# EAGLE design keymatrix (EAGLE 5.06)
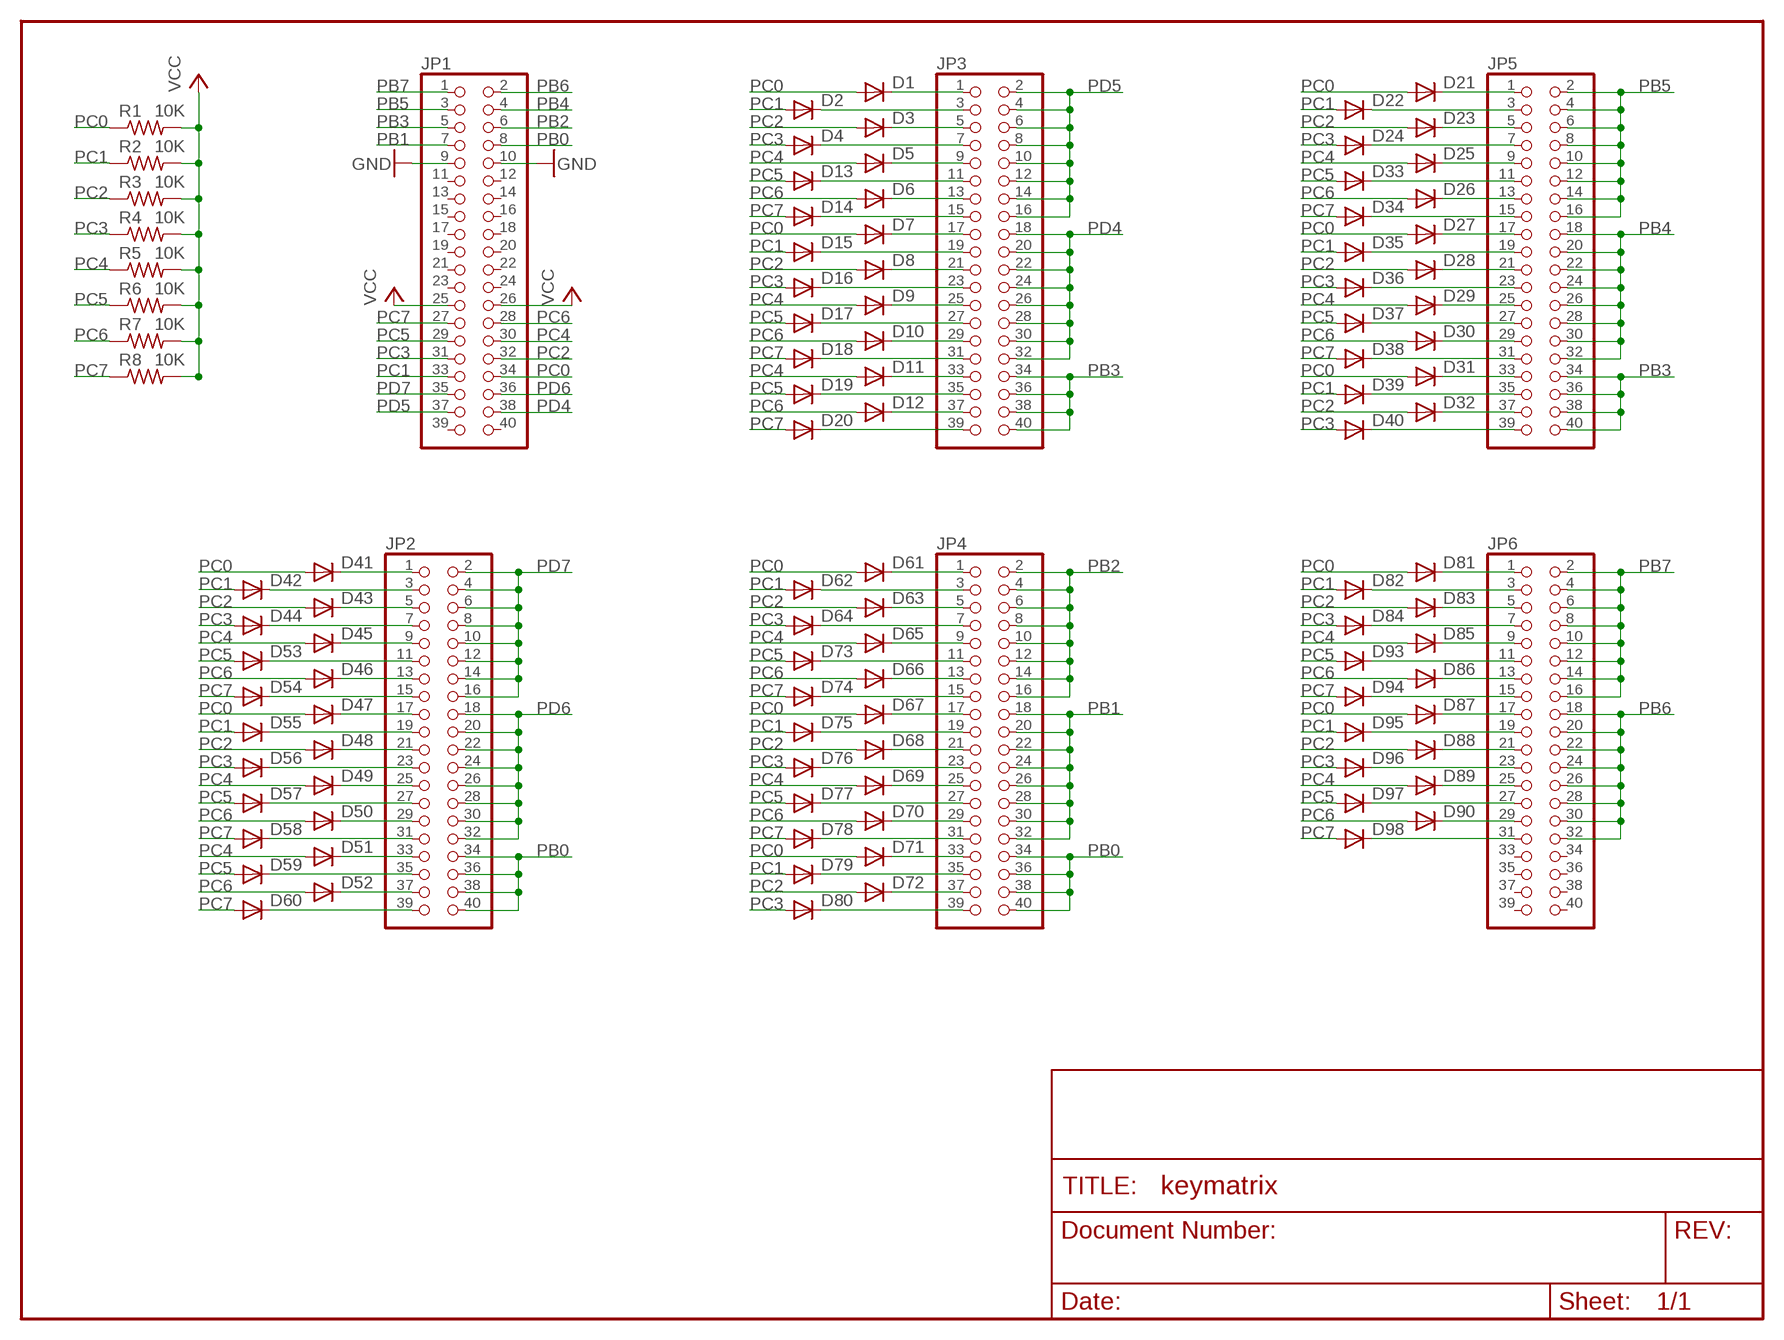
[diagram p0: schematic, sheet 1]

## Parts
D1  1N4148DO35-7  [DO35-7]
D2  1N4148DO35-7  [DO35-7]
D3  1N4148DO35-7  [DO35-7]
D4  1N4148DO35-7  [DO35-7]
D5  1N4148DO35-7  [DO35-7]
D6  1N4148DO35-7  [DO35-7]
D7  1N4148DO35-7  [DO35-7]
D8  1N4148DO35-7  [DO35-7]
D9  1N4148DO35-7  [DO35-7]
D10  1N4148DO35-7  [DO35-7]
D11  1N4148DO35-7  [DO35-7]
D12  1N4148DO35-7  [DO35-7]
D13  1N4148DO35-7  [DO35-7]
D14  1N4148DO35-7  [DO35-7]
D15  1N4148DO35-7  [DO35-7]
D16  1N4148DO35-7  [DO35-7]
D17  1N4148DO35-7  [DO35-7]
D18  1N4148DO35-7  [DO35-7]
D19  1N4148DO35-7  [DO35-7]
D20  1N4148DO35-7  [DO35-7]
D21  1N4148DO35-7  [DO35-7]
D22  1N4148DO35-7  [DO35-7]
D23  1N4148DO35-7  [DO35-7]
D24  1N4148DO35-7  [DO35-7]
D25  1N4148DO35-7  [DO35-7]
D26  1N4148DO35-7  [DO35-7]
D27  1N4148DO35-7  [DO35-7]
D28  1N4148DO35-7  [DO35-7]
D29  1N4148DO35-7  [DO35-7]
D30  1N4148DO35-7  [DO35-7]
D31  1N4148DO35-7  [DO35-7]
D32  1N4148DO35-7  [DO35-7]
D33  1N4148DO35-7  [DO35-7]
D34  1N4148DO35-7  [DO35-7]
D35  1N4148DO35-7  [DO35-7]
D36  1N4148DO35-7  [DO35-7]
D37  1N4148DO35-7  [DO35-7]
D38  1N4148DO35-7  [DO35-7]
D39  1N4148DO35-7  [DO35-7]
D40  1N4148DO35-7  [DO35-7]
D41  1N4148DO35-7  [DO35-7]
D42  1N4148DO35-7  [DO35-7]
D43  1N4148DO35-7  [DO35-7]
D44  1N4148DO35-7  [DO35-7]
D45  1N4148DO35-7  [DO35-7]
D46  1N4148DO35-7  [DO35-7]
D47  1N4148DO35-7  [DO35-7]
D48  1N4148DO35-7  [DO35-7]
D49  1N4148DO35-7  [DO35-7]
D50  1N4148DO35-7  [DO35-7]
D51  1N4148DO35-7  [DO35-7]
D52  1N4148DO35-7  [DO35-7]
D53  1N4148DO35-7  [DO35-7]
D54  1N4148DO35-7  [DO35-7]
D55  1N4148DO35-7  [DO35-7]
D56  1N4148DO35-7  [DO35-7]
D57  1N4148DO35-7  [DO35-7]
D58  1N4148DO35-7  [DO35-7]
D59  1N4148DO35-7  [DO35-7]
D60  1N4148DO35-7  [DO35-7]
D61  1N4148DO35-7  [DO35-7]
D62  1N4148DO35-7  [DO35-7]
D63  1N4148DO35-7  [DO35-7]
D64  1N4148DO35-7  [DO35-7]
D65  1N4148DO35-7  [DO35-7]
D66  1N4148DO35-7  [DO35-7]
D67  1N4148DO35-7  [DO35-7]
D68  1N4148DO35-7  [DO35-7]
D69  1N4148DO35-7  [DO35-7]
D70  1N4148DO35-7  [DO35-7]
D71  1N4148DO35-7  [DO35-7]
D72  1N4148DO35-7  [DO35-7]
D73  1N4148DO35-7  [DO35-7]
D74  1N4148DO35-7  [DO35-7]
D75  1N4148DO35-7  [DO35-7]
D76  1N4148DO35-7  [DO35-7]
D77  1N4148DO35-7  [DO35-7]
D78  1N4148DO35-7  [DO35-7]
D79  1N4148DO35-7  [DO35-7]
D80  1N4148DO35-7  [DO35-7]
D81  1N4148DO35-7  [DO35-7]
D82  1N4148DO35-7  [DO35-7]
D83  1N4148DO35-7  [DO35-7]
D84  1N4148DO35-7  [DO35-7]
D85  1N4148DO35-7  [DO35-7]
D86  1N4148DO35-7  [DO35-7]
D87  1N4148DO35-7  [DO35-7]
D88  1N4148DO35-7  [DO35-7]
D89  1N4148DO35-7  [DO35-7]
D90  1N4148DO35-7  [DO35-7]
D93  1N4148DO35-7  [DO35-7]
D94  1N4148DO35-7  [DO35-7]
D95  1N4148DO35-7  [DO35-7]
D96  1N4148DO35-7  [DO35-7]
D97  1N4148DO35-7  [DO35-7]
D98  1N4148DO35-7  [DO35-7]
JP1  PINHD-2X20  [2X20]
JP2  PINHD-2X20  [2X20]
JP3  PINHD-2X20  [2X20]
JP4  PINHD-2X20  [2X20]
JP5  PINHD-2X20  [2X20]
JP6  PINHD-2X20  [2X20]
R1  10K  R-US_0207/7  [0207/7]
R2  10K  R-US_0207/7  [0207/7]
R3  10K  R-US_0207/7  [0207/7]
R4  10K  R-US_0207/7  [0207/7]
R5  10K  R-US_0207/7  [0207/7]
R6  10K  R-US_0207/7  [0207/7]
R7  10K  R-US_0207/7  [0207/7]
R8  10K  R-US_0207/7  [0207/7]

## Nets
GND: JP1.9 JP1.10
N$1: D1.C JP3.1
N$2: D2.C JP3.3
N$3: D3.C JP3.5
N$4: D4.C JP3.7
N$5: D5.C JP3.9
N$6: D13.C JP3.11
N$7: D6.C JP3.13
N$8: D14.C JP3.15
N$9: D7.C JP3.17
N$10: D15.C JP3.19
N$11: D8.C JP3.21
N$12: D16.C JP3.23
N$13: D9.C JP3.25
N$14: D17.C JP3.27
N$15: D10.C JP3.29
N$16: D18.C JP3.31
N$17: D11.C JP3.33
N$18: D19.C JP3.35
N$19: D12.C JP3.37
N$20: D20.C JP3.39
N$21: D41.C JP2.1
N$22: D21.C JP5.1
N$23: D22.C JP5.3
N$24: D23.C JP5.5
N$25: D24.C JP5.7
N$26: D25.C JP5.9
N$27: D33.C JP5.11
N$28: D26.C JP5.13
N$29: D34.C JP5.15
N$30: D27.C JP5.17
N$31: D35.C JP5.19
N$32: D28.C JP5.21
N$33: D36.C JP5.23
N$34: D29.C JP5.25
N$35: D37.C JP5.27
N$36: D30.C JP5.29
N$37: D38.C JP5.31
N$38: D31.C JP5.33
N$39: D39.C JP5.35
N$40: D32.C JP5.37
N$41: D40.C JP5.39
N$42: D42.C JP2.3
N$43: D43.C JP2.5
N$44: D44.C JP2.7
N$45: D45.C JP2.9
N$46: D53.C JP2.11
N$47: D46.C JP2.13
N$48: D54.C JP2.15
N$49: D47.C JP2.17
N$50: D55.C JP2.19
N$51: D48.C JP2.21
N$52: D56.C JP2.23
N$53: D49.C JP2.25
N$54: D57.C JP2.27
N$55: D50.C JP2.29
N$56: D58.C JP2.31
N$57: D51.C JP2.33
N$58: D59.C JP2.35
N$59: D52.C JP2.37
N$60: D60.C JP2.39
N$61: D61.C JP4.1
N$62: D62.C JP4.3
N$63: D63.C JP4.5
N$64: D64.C JP4.7
N$65: D65.C JP4.9
N$66: D73.C JP4.11
N$67: D66.C JP4.13
N$68: D74.C JP4.15
N$69: D67.C JP4.17
N$70: D75.C JP4.19
N$71: D68.C JP4.21
N$72: D76.C JP4.23
N$73: D69.C JP4.25
N$74: D77.C JP4.27
N$75: D70.C JP4.29
N$76: D78.C JP4.31
N$77: D71.C JP4.33
N$78: D79.C JP4.35
N$79: D72.C JP4.37
N$80: D80.C JP4.39
N$81: D81.C JP6.1
N$82: D82.C JP6.3
N$83: D83.C JP6.5
N$84: D84.C JP6.7
N$85: D85.C JP6.9
N$86: D93.C JP6.11
N$87: D86.C JP6.13
N$88: D94.C JP6.15
N$89: D87.C JP6.17
N$90: D95.C JP6.19
N$91: D88.C JP6.21
N$92: D96.C JP6.23
N$93: D89.C JP6.25
N$94: D97.C JP6.27
N$95: D90.C JP6.29
N$96: D98.C JP6.31
PB0: JP1.8 JP2.34 JP2.36 JP2.38 JP2.40 JP4.34 JP4.36 JP4.38 JP4.40
PB1: JP1.7 JP4.18 JP4.20 JP4.22 JP4.24 JP4.26 JP4.28 JP4.30 JP4.32
PB2: JP1.6 JP4.2 JP4.4 JP4.6 JP4.8 JP4.10 JP4.12 JP4.14 JP4.16
PB3: JP1.5 JP3.34 JP3.36 JP3.38 JP3.40 JP5.34 JP5.36 JP5.38 JP5.40
PB4: JP1.4 JP5.18 JP5.20 JP5.22 JP5.24 JP5.26 JP5.28 JP5.30 JP5.32
PB5: JP1.3 JP5.2 JP5.4 JP5.6 JP5.8 JP5.10 JP5.12 JP5.14 JP5.16
PB6: JP1.2 JP6.18 JP6.20 JP6.22 JP6.24 JP6.26 JP6.28 JP6.30 JP6.32
PB7: JP1.1 JP6.2 JP6.4 JP6.6 JP6.8 JP6.10 JP6.12 JP6.14 JP6.16
PC0: D1.A D7.A D21.A D27.A D31.A D41.A D47.A D61.A D67.A D71.A D81.A D87.A JP1.34 R1.1
PC1: D2.A D15.A D22.A D35.A D39.A D42.A D55.A D62.A D75.A D79.A D82.A D95.A JP1.33 R2.1
PC2: D3.A D8.A D23.A D28.A D32.A D43.A D48.A D63.A D68.A D72.A D83.A D88.A JP1.32 R3.1
PC3: D4.A D16.A D24.A D36.A D40.A D44.A D56.A D64.A D76.A D80.A D84.A D96.A JP1.31 R4.1
PC4: D5.A D9.A D11.A D25.A D29.A D45.A D49.A D51.A D65.A D69.A D85.A D89.A JP1.30 R5.1
PC5: D13.A D17.A D19.A D33.A D37.A D53.A D57.A D59.A D73.A D77.A D93.A D97.A JP1.29 R6.1
PC6: D6.A D10.A D12.A D26.A D30.A D46.A D50.A D52.A D66.A D70.A D86.A D90.A JP1.28 R7.1
PC7: D14.A D18.A D20.A D34.A D38.A D54.A D58.A D60.A D74.A D78.A D94.A D98.A JP1.27 R8.1
PD4: JP1.38 JP3.18 JP3.20 JP3.22 JP3.24 JP3.26 JP3.28 JP3.30 JP3.32
PD5: JP1.37 JP3.2 JP3.4 JP3.6 JP3.8 JP3.10 JP3.12 JP3.14 JP3.16
PD6: JP1.36 JP2.18 JP2.20 JP2.22 JP2.24 JP2.26 JP2.28 JP2.30 JP2.32
PD7: JP1.35 JP2.2 JP2.4 JP2.6 JP2.8 JP2.10 JP2.12 JP2.14 JP2.16
VCC: JP1.25 JP1.26 R1.2 R2.2 R3.2 R4.2 R5.2 R6.2 R7.2 R8.2
Unconnected: JP1.11 JP1.12 JP1.13 JP1.14 JP1.15 JP1.16 JP1.17 JP1.18 JP1.19 JP1.20 JP1.21 JP1.22 JP1.23 JP1.24 JP1.39 JP1.40 JP6.33 JP6.34 JP6.35 JP6.36 JP6.37 JP6.38 JP6.39 JP6.40

## Library data of the parts
D1-D90 D93-D98 = diode:1N4148: DIODE high speed (Philips)
JP1-JP6 = pinhead:PINHD-2X20: PIN HEADER
R1-R8 = resistor:R-US_: RESISTOR, American symbol

## Board
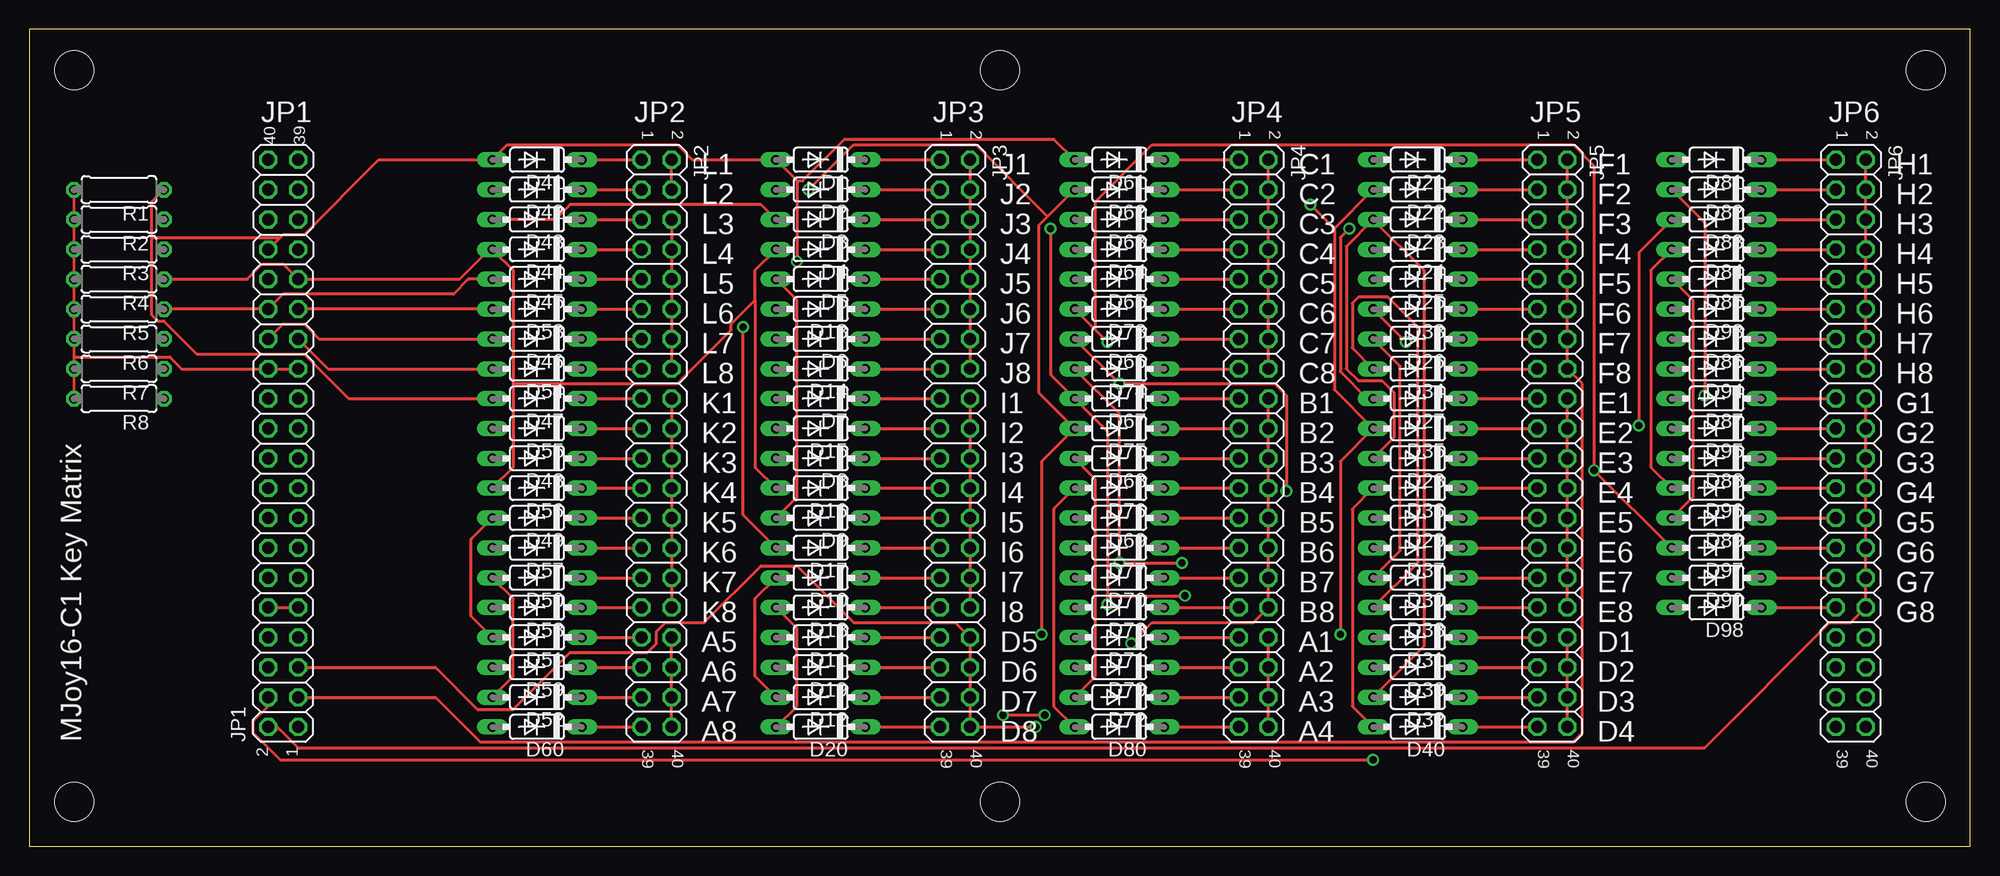
[diagram p1: board, top side]
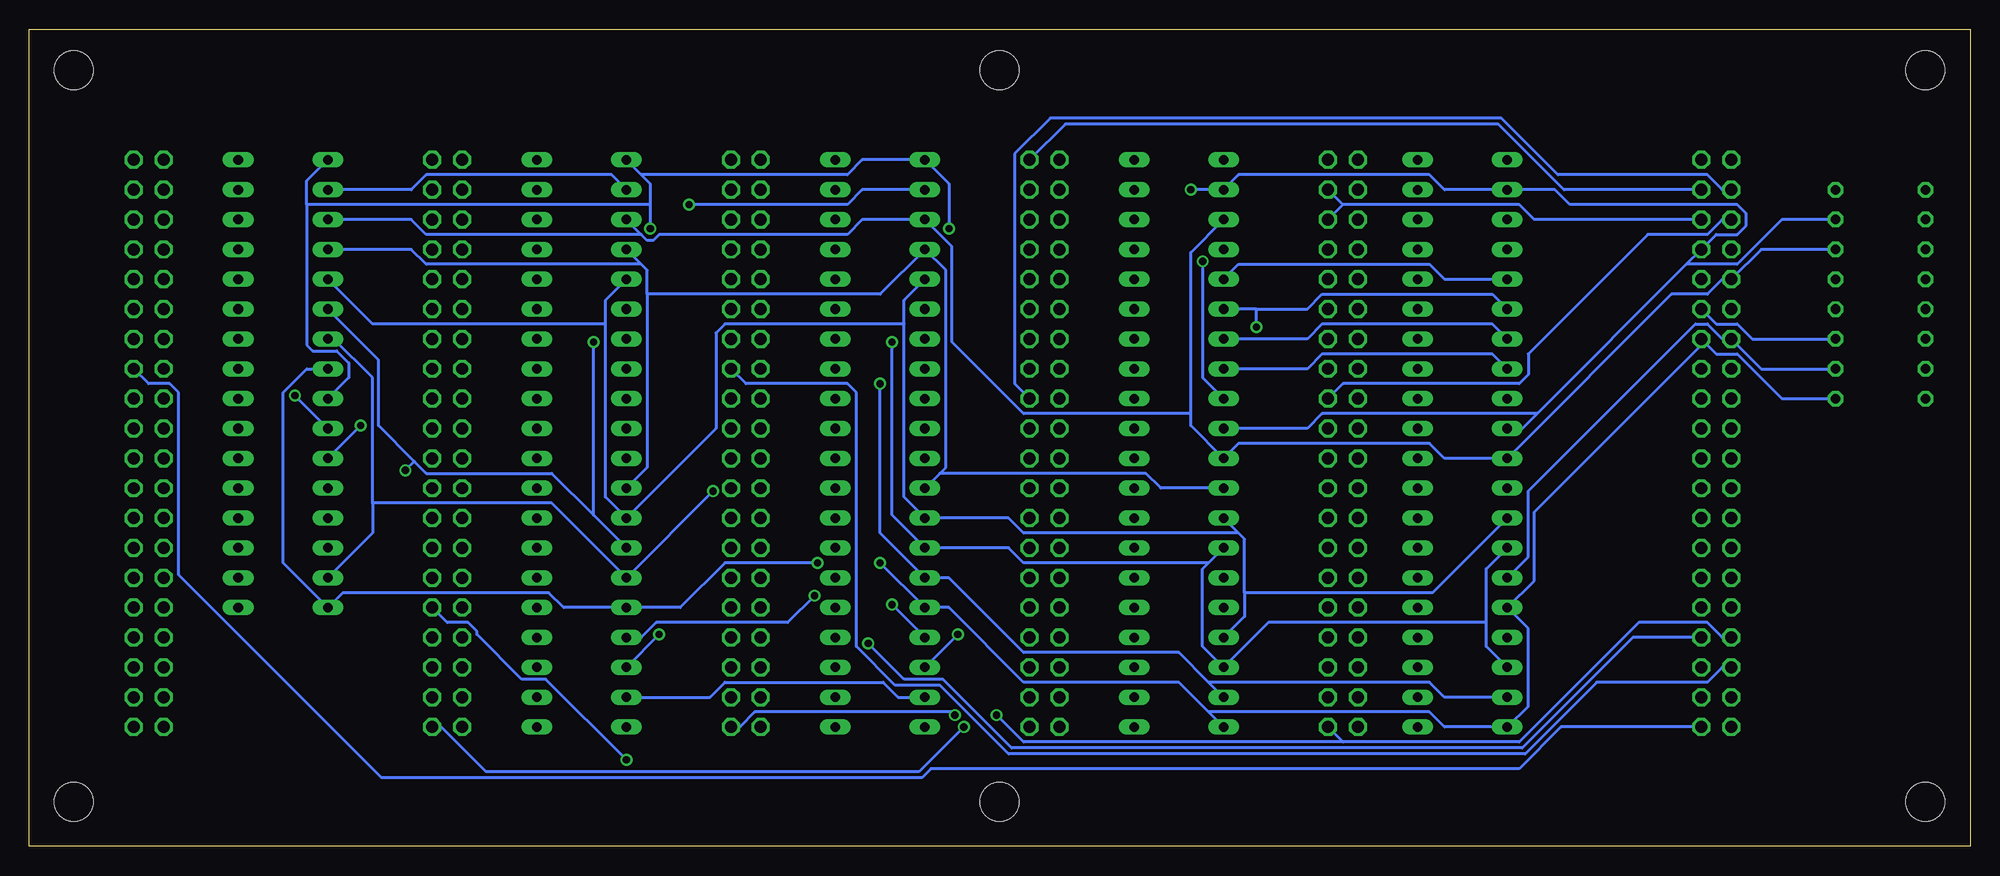
[diagram p2: board, bottom side, seen from below]

Size 165.08 x 69.52 mm. Coordinates in mm from the lower left corner, seen from the top.
Outline: 0,0 165.08,0 165.08,69.52 0,69.52 0,0
Copper layers (1*16): Top 0.035mm / dielectric 1.5mm / Bottom 0.035mm
Design rules "default": minimum track width 10mil, minimum drill 24mil, track to track 8mil, track to pad 8mil, pad to pad 8mil, via to via 8mil, smd to smd 8mil, copper to edge 40mil, drill to drill 8mil, minimum pad ring 10mil, minimum via ring 8mil, stop-mask expansion 4mil, vias tented up to drill 0mil, thermal gap 10mil

### Footprints (pad centres in the part's own frame; a part is rotated, then mirrored left to right if it is on the bottom)
DO35-7 = drill 0.813 long: A 3.81,0; C -3.81,0
2X20 = drill 1.016 octagon: 1 -24.13,-1.27; 2 -24.13,1.27; 3 -21.59,-1.27; 4 -21.59,1.27; 5 -19.05,-1.27; 6 -19.05,1.27; 7 -16.51,-1.27; 8 -16.51,1.27; 9 -13.97,-1.27; 10 -13.97,1.27; 11 -11.43,-1.27; 12 -11.43,1.27; 13 -8.89,-1.27; 14 -8.89,1.27; 15 -6.35,-1.27; 16 -6.35,1.27; 17 -3.81,-1.27; 18 -3.81,1.27; 19 -1.27,-1.27; 20 -1.27,1.27; 21 1.27,-1.27; 22 1.27,1.27; 23 3.81,-1.27; 24 3.81,1.27; 25 6.35,-1.27; 26 6.35,1.27; 27 8.89,-1.27; 28 8.89,1.27; 29 11.43,-1.27; 30 11.43,1.27; 31 13.97,-1.27; 32 13.97,1.27; 33 16.51,-1.27; 34 16.51,1.27; 35 19.05,-1.27; 36 19.05,1.27; 37 21.59,-1.27; 38 21.59,1.27; 39 24.13,-1.27; 40 24.13,1.27
0207/7 = drill 0.813 octagon: 1 -3.81,0; 2 3.81,0
STAND-OFF = hole 3.302: 0,0

### Placement (x,y rotation side)
D1  67.31,58.42 180 top
D2  67.31,55.88 180 top
D3  67.31,53.34 180 top
D4  67.31,50.8 180 top
D5  67.31,48.26 180 top
D6  67.31,43.18 180 top
D7  67.31,38.1 180 top
D8  67.31,33.02 180 top
D9  67.31,27.94 180 top
D10  67.31,22.86 180 top
D11  67.31,17.78 180 top
D12  67.31,12.7 180 top
D13  67.31,45.72 180 top
D14  67.31,40.64 180 top
D15  67.31,35.56 180 top
D16  67.31,30.48 180 top
D17  67.31,25.4 180 top
D18  67.31,20.32 180 top
D19  67.31,15.24 180 top
D20  67.31,10.16 180 top
D21  118.11,58.42 180 top
D22  118.11,55.88 180 top
D23  118.11,53.34 180 top
D24  118.11,50.8 180 top
D25  118.11,48.26 180 top
D26  118.11,43.18 180 top
D27  118.11,38.1 180 top
D28  118.11,33.02 180 top
D29  118.11,27.94 180 top
D30  118.11,22.86 180 top
D31  118.11,17.78 180 top
D32  118.11,12.7 180 top
D33  118.11,45.72 180 top
D34  118.11,40.64 180 top
D35  118.11,35.56 180 top
D36  118.11,30.48 180 top
D37  118.11,25.4 180 top
D38  118.11,20.32 180 top
D39  118.11,15.24 180 top
D40  118.11,10.16 180 top
D41  43.18,58.42 180 top
D42  43.18,55.88 180 top
D43  43.18,53.34 180 top
D44  43.18,50.8 180 top
D45  43.18,48.26 180 top
D46  43.18,43.18 180 top
D47  43.18,38.1 180 top
D48  43.18,33.02 180 top
D49  43.18,27.94 180 top
D50  43.18,22.86 180 top
D51  43.18,17.78 180 top
D52  43.18,12.7 180 top
D53  43.18,45.72 180 top
D54  43.18,40.64 180 top
D55  43.18,35.56 180 top
D56  43.18,30.48 180 top
D57  43.18,25.4 180 top
D58  43.18,20.32 180 top
D59  43.18,15.24 180 top
D60  43.18,10.16 180 top
D61  92.71,58.42 180 top
D62  92.71,55.88 180 top
D63  92.71,53.34 180 top
D64  92.71,50.8 180 top
D65  92.71,48.26 180 top
D66  92.71,43.18 180 top
D67  92.71,38.1 180 top
D68  92.71,33.02 180 top
D69  92.71,27.94 180 top
D70  92.71,22.86 180 top
D71  92.71,17.78 180 top
D72  92.71,12.7 180 top
D73  92.71,45.72 180 top
D74  92.71,40.64 180 top
D75  92.71,35.56 180 top
D76  92.71,30.48 180 top
D77  92.71,25.4 180 top
D78  92.71,20.32 180 top
D79  92.71,15.24 180 top
D80  92.71,10.16 180 top
D81  143.51,58.42 180 top
D82  143.51,55.88 180 top
D83  143.51,53.34 180 top
D84  143.51,50.8 180 top
D85  143.51,48.26 180 top
D86  143.51,43.18 180 top
D87  143.51,38.1 180 top
D88  143.51,33.02 180 top
D89  143.51,27.94 180 top
D90  143.51,22.86 180 top
D93  143.51,45.72 180 top
D94  143.51,40.64 180 top
D95  143.51,35.56 180 top
D96  143.51,30.48 180 top
D97  143.51,25.4 180 top
D98  143.51,20.32 180 top
JP1  21.59,34.29 90 top
JP2  53.34,34.29 270 top
JP3  78.74,34.29 270 top
JP4  104.14,34.29 270 top
JP5  129.54,34.29 270 top
JP6  154.94,34.29 270 top
R1  7.62,55.88 180 top
R2  7.62,53.34 180 top
R3  7.62,50.8 180 top
R4  7.62,48.26 180 top
R5  7.62,45.72 180 top
R6  7.62,43.18 180 top
R7  7.62,40.64 180 top
R8  7.62,38.1 180 top
U$1  [STAND-OFF]  3.81,3.81 0 top
U$2  [STAND-OFF]  3.81,66.04 0 top
U$3  [STAND-OFF]  161.29,3.81 0 top
U$4  [STAND-OFF]  161.29,66.04 0 top
U$5  [STAND-OFF]  82.55,66.04 0 top
U$6  [STAND-OFF]  82.55,3.81 0 top

### Tracks (layer width: path | path; a pad name or v marks a point on that pad's centre or on a via)
GND
  Top 0.254: JP1.10 JP1.9
N$1
  Top 0.254: D1.C JP3.1
N$2
  Top 0.254: D2.C JP3.3
N$3
  Top 0.254: D3.C JP3.5
N$4
  Top 0.254: D4.C JP3.7
N$5
  Top 0.254: D5.C JP3.9
N$6
  Top 0.254: D13.C JP3.11
N$7
  Top 0.254: D6.C JP3.13
N$8
  Top 0.254: D14.C JP3.15
N$9
  Top 0.254: D7.C JP3.17
N$10
  Top 0.254: D15.C JP3.19
N$11
  Top 0.254: D8.C JP3.21
N$12
  Top 0.254: D16.C JP3.23
N$13
  Top 0.254: D9.C JP3.25
N$14
  Top 0.254: D17.C JP3.27
N$15
  Top 0.254: D10.C JP3.29
N$16
  Top 0.254: D18.C JP3.31
N$17
  Top 0.254: D11.C JP3.33
N$18
  Top 0.254: D19.C JP3.35
N$19
  Top 0.254: D12.C JP3.37
N$20
  Top 0.254: D20.C JP3.39
N$21
  Top 0.254: D41.C JP2.1
N$22
  Top 0.254: D21.C JP5.1
N$23
  Top 0.254: D22.C JP5.3
N$24
  Top 0.254: D23.C JP5.5
N$25
  Top 0.254: D24.C JP5.7
N$26
  Top 0.254: D25.C JP5.9
N$27
  Top 0.254: D33.C JP5.11
N$28
  Top 0.254: D26.C JP5.13
N$29
  Top 0.254: D34.C JP5.15
N$30
  Top 0.254: D27.C JP5.17
N$31
  Top 0.254: D35.C JP5.19
N$32
  Top 0.254: D28.C JP5.21
N$33
  Top 0.254: D36.C JP5.23
N$34
  Top 0.254: D29.C JP5.25
N$35
  Top 0.254: D37.C JP5.27
N$36
  Top 0.254: D30.C JP5.29
N$37
  Top 0.254: D38.C JP5.31
N$38
  Top 0.254: D31.C JP5.33
N$39
  Top 0.254: D39.C JP5.35
N$40
  Top 0.254: D32.C JP5.37
N$41
  Top 0.254: D40.C JP5.39
N$42
  Top 0.254: D42.C JP2.3
N$43
  Top 0.254: D43.C JP2.5
N$44
  Top 0.254: D44.C JP2.7
N$45
  Top 0.254: D45.C JP2.9
N$46
  Top 0.254: D53.C JP2.11
N$47
  Top 0.254: D46.C JP2.13
N$48
  Top 0.254: D54.C JP2.15
N$49
  Top 0.254: D47.C JP2.17
N$50
  Top 0.254: D55.C JP2.19
N$51
  Top 0.254: D48.C JP2.21
N$52
  Top 0.254: D56.C JP2.23
N$53
  Top 0.254: D49.C JP2.25
N$54
  Top 0.254: D57.C JP2.27
N$55
  Top 0.254: D50.C JP2.29
N$56
  Top 0.254: D58.C JP2.31
N$57
  Top 0.254: D51.C JP2.33
N$58
  Top 0.254: D59.C JP2.35
N$59
  Top 0.254: D52.C JP2.37
N$60
  Top 0.254: D60.C JP2.39
N$61
  Top 0.254: D61.C JP4.1
N$62
  Top 0.254: D62.C JP4.3
N$63
  Top 0.254: D63.C JP4.5
N$64
  Top 0.254: D64.C JP4.7
N$65
  Top 0.254: D65.C JP4.9
N$66
  Top 0.254: D73.C JP4.11
N$67
  Top 0.254: D66.C JP4.13
N$68
  Top 0.254: D74.C JP4.15
N$69
  Top 0.254: D67.C JP4.17
N$70
  Top 0.254: D75.C JP4.19
N$71
  Top 0.254: D68.C JP4.21
N$72
  Top 0.254: D76.C JP4.23
N$73
  Top 0.254: D69.C JP4.25
N$74
  Top 0.254: D77.C JP4.27
N$75
  Top 0.254: D70.C JP4.29
N$76
  Top 0.254: D78.C JP4.31
N$77
  Top 0.254: D71.C JP4.33
N$78
  Top 0.254: D79.C JP4.35
N$79
  Top 0.254: D72.C JP4.37
N$80
  Top 0.254: D80.C JP4.39
N$81
  Top 0.254: D81.C JP6.1
N$82
  Top 0.254: D82.C JP6.3
N$83
  Top 0.254: D83.C JP6.5
N$84
  Top 0.254: D84.C JP6.7
N$85
  Top 0.254: D85.C JP6.9
N$86
  Top 0.254: D93.C JP6.11
N$87
  Top 0.254: D86.C JP6.13
N$88
  Top 0.254: D94.C JP6.15
N$89
  Top 0.254: D87.C JP6.17
N$90
  Top 0.254: D95.C JP6.19
N$91
  Top 0.254: D88.C JP6.21
N$92
  Top 0.254: D96.C JP6.23
N$93
  Top 0.254: D89.C JP6.25
N$94
  Top 0.254: D97.C JP6.27
N$95
  Top 0.254: D90.C JP6.29
N$96
  Top 0.254: D98.C JP6.31
PB0  (via drill 0.61)
  Top 0.254: JP4.40 JP4.38 JP4.36 JP4.34 | JP2.34 JP2.36 JP2.38 JP2.40 | v82.8,11.18 v86.36,11.18
  Bottom 0.254: JP1.8 21.08,17.78 22.35,19.05 28.19,19.05 38.35,8.89 53.34,8.89 | 53.34,8.89 JP2.40 | JP4.40 104.65,10.16 103.38,11.43 86.61,11.43 v86.36,11.18 | v82.8,11.18 80.52,8.89 53.34,8.89
PB1  (via drill 0.61)
  Top 0.254: JP4.18 JP4.20 JP4.22 JP4.24 JP4.26 JP4.28 JP4.30 JP4.32 104.14,19.05 95.5,19.05 v93.73,17.27
  Bottom 0.254: JP1.7 28.7,17.78 38.1,8.38 81.53,8.38 87.38,14.22 90.68,14.22 v93.73,17.27
PB2
  Top 0.254: JP4.2 JP4.4 JP4.6 JP4.8 JP4.10 JP4.12 JP4.14 JP4.16
  Bottom 0.254: JP1.6 21.08,15.24 22.35,13.97 31.75,13.97 37.85,7.87 81.79,7.87 87.63,13.72 91.44,13.72 94.74,17.02 94.74,38.61 95.5,39.37 104.14,39.37 JP4.16
PB3  (via drill 0.61)
  Top 0.254: JP5.40 JP5.38 JP5.36 JP5.34 | JP1.5 34.54,15.24 38.1,11.68 41.15,11.68 45.97,16.51 52.58,16.51 53.34,17.27 53.34,18.29 54.1,19.05 57.4,19.05 62.23,23.88 65.28,23.88 70.1,19.05 78.74,19.05 JP3.34 JP3.36 JP3.38 JP3.40 v85.6,10.16
  Bottom 0.254: JP5.40 130.05,10.16 126.24,6.35 89.41,6.35 v85.6,10.16
PB4  (via drill 0.61)
  Top 0.254: JP5.18 JP5.20 JP5.22 JP5.24 JP5.26 JP5.28 JP5.30 JP5.32 | JP1.4 20.32,11.94 19.05,10.67 19.05,9.65 21.34,7.37 v114.3,7.37
  Bottom 0.254: v114.3,7.37 121.16,14.22 123.19,14.22 127,18.03 127,18.29 127.76,19.05 129.54,19.05 JP5.32
PB5
  Top 0.254: JP5.2 JP5.4 JP5.6 JP5.8 JP5.10 JP5.12 JP5.14 JP5.16 132.08,39.37 132.08,9.65 131.32,8.89 38.35,8.89 34.54,12.7 JP1.3
PB6
  Top 0.254: JP6.18 JP6.20 JP6.22 JP6.24 JP6.26 JP6.28 JP6.30 JP6.32 154.94,19.05 153.16,19.05 142.49,8.38 22.86,8.38 21.08,10.16 JP1.2
PB7
  Top 0.254: JP6.2 JP6.4 JP6.6 JP6.8 JP6.10 JP6.12 JP6.14 JP6.16
  Bottom 0.254: JP1.1 34.8,10.16 38.35,6.6 88.39,6.6 89.15,5.84 135.13,5.84 152.4,23.11 152.4,38.61 153.16,39.37 154.94,39.37 JP6.16
PC0  (via drill 0.61)
  Top 0.254: D47.A 27.18,38.1 23.37,41.91 14.22,41.91 11.43,44.7 10.92,44.7 10.41,45.21 10.41,51.82 | 10.41,51.82 10.41,54.86 R1.1 | 65.28,56.64 v65.28,49.78 | 65.28,56.64 D1.A 56.39,58.42 55.12,59.69 40.64,59.69 D41.A 29.72,58.42 23.37,52.07 21.59,52.07 21.34,51.82 | 21.34,51.82 JP1.34 | 10.41,51.82 21.34,51.82 | 91.69,21.34 91.69,35.31 D67.A 86.87,40.13 v86.87,52.58 | 91.69,21.34 v91.69,20.57 | 91.69,21.34 v98.3,21.34 | D27.A 113.79,38.1 111.51,40.39 111.51,51.82 v112.27,52.58 | 65.28,56.64 65.79,56.64 69.34,60.2 87.12,60.2 D61.A
  Bottom 0.254: D7.A 65.28,39.88 v65.28,49.78 | v91.69,20.57 D71.A | D31.A 113.03,17.78 111.76,19.05 100.58,19.05 v98.3,21.34 | D87.A 137.92,39.88 137.92,41.15 138.94,42.16 140.97,42.16 141.48,42.67 141.48,54.61 | 141.48,54.61 141.48,56.64 D81.A | 112.27,54.61 112.27,56.39 113.03,57.15 | 112.27,54.61 v112.27,52.58 | 113.03,57.15 D21.A | 113.03,57.15 95.5,57.15 94.23,58.42 D61.A 86.87,56.39 v86.87,52.58 | 112.27,54.61 141.48,54.61
PC1  (via drill 0.61)
  Top 0.254: v86.11,18.03 86.11,32.77 D75.A 85.85,38.61 85.85,52.83 86.61,53.59 | 86.61,53.59 D62.A | v142.49,38.35 142.49,53.09 D82.A | v111.51,18.03 111.51,32.77 D35.A 111,38.86 111,52.58 | 111,52.58 D22.A | v108.97,54.61 111,52.58 | v66.29,55.88 70.1,59.69 80.52,59.69 86.61,53.59
  Bottom 0.254: D55.A 38.1,35.56 36.83,36.83 | 24.13,49.53 JP1.33 21.59,52.07 19.81,52.07 19.05,52.83 19.05,53.85 19.81,54.61 34.04,54.61 35.31,55.88 D42.A 44.7,55.88 45.97,57.15 62.23,57.15 D2.A v66.29,55.88 | 24.13,49.53 36.83,36.83 | D15.A 56.39,35.56 55.12,36.83 36.83,36.83 | R2.1 16,53.34 19.81,49.53 24.13,49.53 | v86.11,18.03 D79.A | v142.49,38.35 D95.A | v111.51,18.03 D39.A | D82.A 132.59,55.88 131.32,57.15 115.57,57.15 D22.A | D62.A 94.23,55.88 95.5,54.61 v108.97,54.61
PC2  (via drill 0.61)
  Top 0.254: D43.A 44.7,53.34 45.97,54.61 62.23,54.61 D3.A | D72.A 90.68,14.48 90.68,31.24 D68.A | v136.91,35.81 136.91,50.55 D83.A | D28.A 116.08,34.8 116.08,38.61 115.06,39.62 113.03,39.62 112.01,40.64 112.01,51.05 D23.A 118.62,49.02 118.62,17.02 D32.A
  Bottom 0.254: R3.1 17.78,50.8 JP1.32 21.08,48.26 22.35,46.99 25.4,46.99 D48.A 44.7,33.02 45.97,34.29 62.23,34.29 D8.A 66.29,35.81 66.29,36.83 | D3.A 66.29,50.55 66.29,36.83 | D32.A 107.19,12.7 105.92,13.97 92.46,13.97 91.19,12.7 D72.A | v136.91,35.81 D88.A | 113.03,52.07 D23.A | 113.03,52.07 112.52,51.56 112.01,51.56 111.51,52.07 95.5,52.07 94.23,53.34 D63.A 86.61,51.05 86.61,42.93 80.52,36.83 66.29,36.83 | D83.A 132.59,53.34 131.32,52.07 113.03,52.07
PC3
  Top 0.254: D96.A 137.92,32.26 137.92,49.02 D84.A | D40.A 112.52,11.94 112.52,28.7 D36.A | R4.1 18.54,48.26 19.81,49.53 21.59,49.53 JP1.31 36.58,48.26 39.12,50.8 D44.A 41.15,49.02 41.15,39.37 | D56.A 41.15,32.26 41.15,39.37 | D16.A 61.72,32.26 61.72,46.48 | 61.72,46.48 61.72,49.02 D4.A | D80.A 87.12,11.94 87.12,28.7 D76.A | 41.15,39.37 55.12,39.37 59.69,43.94 59.69,44.45 61.72,46.48
  Bottom 0.254: 113.03,49.53 112.52,49.02 112.52,46.99 | 113.03,49.53 D24.A | 112.52,46.99 112.52,32.26 D36.A | D84.A 132.59,50.8 131.32,49.53 113.03,49.53 | 87.63,31.75 D76.A | 87.63,31.75 87.12,32.26 87.12,49.02 D64.A 92.71,46.99 112.52,46.99 | D16.A 68.83,30.48 70.1,31.75 87.63,31.75
PC4
  Top 0.254: D89.A 141.48,29.72 141.48,46.48 D85.A | R5.1 JP1.30 21.59,46.99 36.07,46.99 37.34,48.26 D45.A | D51.A 37.59,19.56 37.59,26.16 D49.A | D5.A 65.28,46.48 65.28,29.72 D9.A
  Bottom 0.254: 116.08,44.45 116.08,46.48 D25.A | 116.08,44.45 116.08,29.72 D29.A 106.68,35.56 106.68,43.69 105.92,44.45 90.68,44.45 | 116.08,44.45 135.89,44.45 D85.A | 90.68,44.45 90.68,46.48 D65.A | 90.68,44.45 90.68,29.72 D69.A 81.79,27.94 80.52,26.67 62.23,26.67 | D11.A 61.72,19.56 61.72,21.59 | 61.72,21.59 61.72,26.16 62.23,26.67 | 62.23,26.67 D9.A | D49.A 45.72,21.59 61.72,21.59 | D45.A 44.7,48.26 45.97,49.53 62.23,49.53 D5.A
PC5  (via drill 0.61)
  Top 0.254: D53.A JP1.29 | D97.A v133.1,32 133.1,57.91 131.32,59.69 95.5,59.69 90.68,54.86 90.68,43.94 | v117.09,42.93 D33.A | v91.69,42.93 90.68,43.94 | 90.68,43.94 D73.A | v60.71,44.2 60.71,28.19 D17.A
  Bottom 0.254: R6.1 18.54,43.18 19.81,44.45 21.59,44.45 JP1.29 | 60.71,45.72 56.39,45.72 55.12,46.99 40.64,46.99 D53.A | 60.71,45.72 D13.A | 117.09,28.19 120.65,31.75 131.32,31.75 132.33,32.77 | 117.09,28.19 D37.A | 132.33,32.77 135.38,35.81 135.38,41.4 D93.A | v133.1,32 132.33,32.77 | 117.09,28.19 v117.09,42.93 | D59.A 41.15,17.02 41.15,19.05 | 41.15,19.05 41.15,23.62 D57.A | 64.77,24.13 D17.A | 64.77,24.13 65.28,23.62 65.28,17.02 D19.A 59.69,19.05 41.15,19.05 | 64.77,24.13 80.52,24.13 81.79,25.4 D77.A 91.69,28.19 v91.69,42.93 | v60.71,44.2 60.71,45.72
PC6  (via drill 0.61)
  Top 0.254: D46.A 24.64,43.18 23.37,44.45 21.59,44.45 JP1.28 | D30.A 116.59,25.15 116.59,40.89 D26.A | D52.A 41.15,14.48 41.15,21.08 D50.A | D12.A 61.72,14.48 61.72,21.08 D10.A | D66.A v92.71,39.37 105.92,39.37 106.93,38.35 v106.93,30.23
  Bottom 0.254: R7.1 17.78,40.64 JP1.28 21.08,43.18 22.35,44.45 23.37,44.45 37.59,30.23 37.59,24.64 D50.A | D6.A 56.39,43.18 55.12,44.45 40.64,44.45 D46.A | D90.A 135.89,26.67 135.89,29.21 | 135.89,29.21 135.89,39.88 139.19,43.18 D86.A | 135.89,29.21 120.65,29.21 D30.A v106.93,30.23 | 64.77,13.97 D12.A | 64.77,13.97 67.31,16.51 80.52,16.51 86.87,22.86 D70.A 92.71,26.67 v92.71,39.37 | D52.A 44.7,12.7 45.97,13.97 64.77,13.97
PC7  (via drill 0.61)
  Top 0.254: D54.A 25.4,40.64 JP1.27 | D34.A 112.52,42.42 112.52,46.23 113.03,46.74 115.57,46.74 118.11,44.2 118.11,24.13 D38.A | D20.A 65.28,11.94 65.28,18.54 D18.A | D74.A 92.71,36.83 v92.71,24.13 v98.04,24.13
  Bottom 0.254: R8.1 16,38.1 19.81,41.91 21.59,41.91 22.61,42.93 | 22.61,42.93 JP1.27 22.61,42.93 | D14.A 56.39,40.64 55.12,41.91 40.64,41.91 D54.A | D94.A 141.48,40.64 143.51,38.61 143.51,24.13 D98.A 138.43,21.59 120.9,21.59 119.63,20.32 D38.A 109.73,20.32 105.92,24.13 v98.04,24.13 | 64.77,11.43 D20.A | 64.77,11.43 67.31,13.97 80.52,13.97 86.87,20.32 D78.A v92.71,24.13 | 64.77,11.43 45.97,11.43 44.7,10.16 D60.A 37.59,11.94 37.59,18.54 D58.A 37.08,22.61 37.08,28.45 22.61,42.93
PD4
  Top 0.254: JP3.32 JP3.30 JP3.28 JP3.26 JP3.24 JP3.22 JP3.20 JP3.18
  Bottom 0.254: JP1.38 21.08,55.88 22.35,57.15 35.05,57.15 39.88,61.98 78.23,61.98 81.28,58.93 81.28,39.37 JP3.18
PD5
  Top 0.254: JP3.16 JP3.14 JP3.12 JP3.10 JP3.8 JP3.6 JP3.4 JP3.2
  Bottom 0.254: JP1.37 34.54,55.88 40.13,61.47 76.96,61.47 JP3.2
PD6
  Top 0.254: JP2.32 JP2.30 JP2.28 JP2.26 JP2.24 JP2.22 JP2.20 JP2.18
  Bottom 0.254: JP1.36 21.08,53.34 22.35,52.07 27.43,52.07 37.59,41.91 37.59,40.13 38.35,39.37 53.34,39.37 JP2.18
PD7
  Top 0.254: JP2.16 JP2.14 JP2.12 JP2.10 JP2.8 JP2.6 | JP2.4 JP2.2
  Bottom 0.254: JP1.35 37.08,53.34 38.35,54.61 53.34,54.61 | 53.34,54.61 JP2.4 | 53.34,54.61 JP2.6
VCC
  Top 0.254: JP1.25 JP1.26 12.95,40.64 11.94,41.66 3.81,41.66 | R1.2 R2.2 R3.2 R4.2 R5.2 R6.2 3.81,41.66 | R8.2 R7.2 3.81,41.66

### Text on the board
tPlace: JP1 | JP2 | JP3 | JP4 | JP5 | JP6 | 1 | 2 | 1 | 2 | 1 | 2 | 1 | 2 | 1 | 2 | 40 | 39 | L1 | J1 | C1 | F1 | H1 | L2 | J2 | C2 | F2 | H2 | L3 | J3 | C3 | F3 | H3 | L4 | J4 | C4 | F4 | H4 | L5 | J5 | C5 | F5 | H5 | L6 | J6 | C6 | F6 | H6 | L7 | J7 | C7 | F7 | H7 | L8 | J8 | C8 | F8 | H8 | K1 | I1 | B1 | E1 | G1 | K2 | I2 | B2 | E2 | G2 | K3 | I3 | B3 | E3 | G3 | K4 | I4 | B4 | E4 | G4 | K5 | I5 | B5 | E5 | G5 | K6 | I6 | B6 | E6 | G6 | K7 | I7 | B7 | E7 | G7 | K8 | I8 | B8 | E8 | G8 | A5 | D5 | A1 | D1 | A6 | D6 | A2 | D2 | A7 | D7 | A3 | D3 | MJoy16-C1 Key Matrix | A8 | D8 | A4 | D4 | 2 | 1 | 39 | 40 | 39 | 40 | 39 | 40 | 39 | 40 | 39 | 40